# Altium schematic sheet HS0038_BOARD.SchDoc
size 420 x 297 mm; SheetNumber: 1; SheetTotal: 1
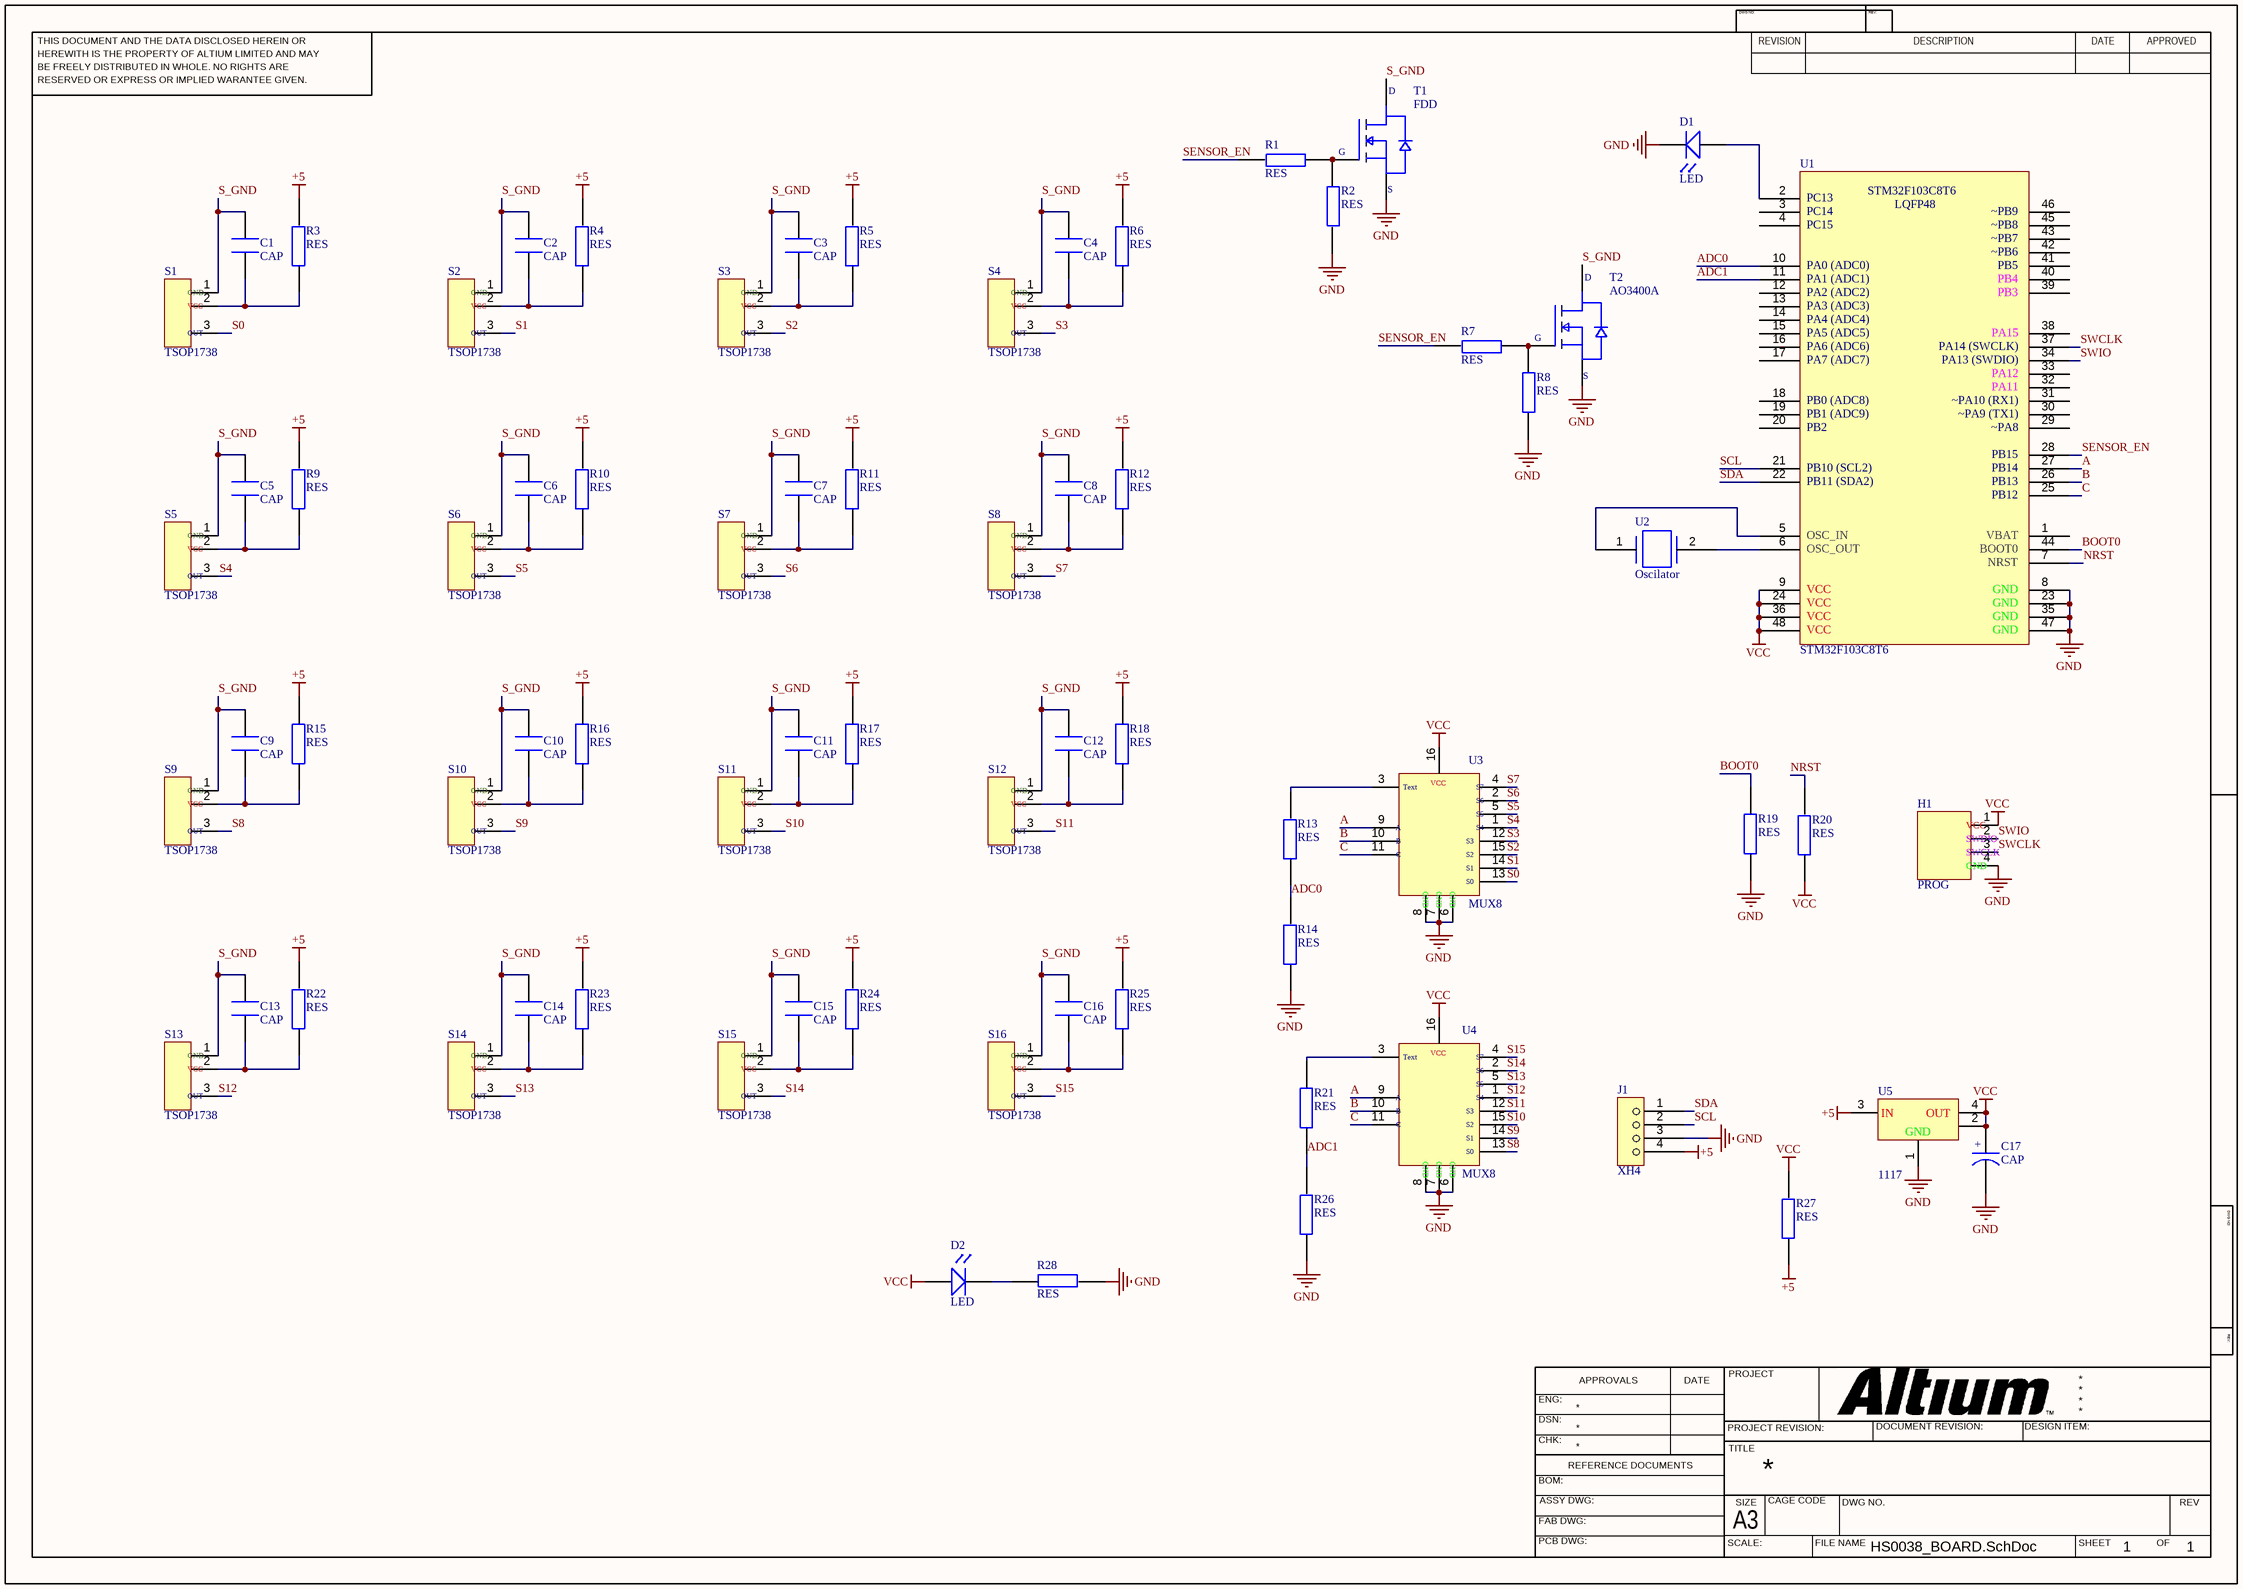
[diagram p0: HS0038_BOARD.SchDoc]

## Parts
C1  CAP  [CAP1206]
C2  CAP  [CAP1206]
C3  CAP  [CAP1206]
C4  CAP  [CAP1206]
C5  CAP  [CAP1206]
C6  CAP  [CAP1206]
C7  CAP  [CAP1206]
C8  CAP  [CAP1206]
C9  CAP  [CAP1206]
C10  CAP  [CAP1206]
C11  CAP  [CAP1206]
C12  CAP  [CAP1206]
C13  CAP  [CAP1206]
C14  CAP  [CAP1206]
C15  CAP  [CAP1206]
C16  CAP  [CAP1206]
C17  CAP  [CAP SMD 100uF 16V]
D1  LED  [LED GREEN 1206]
D2  LED  [LED GREEN 1206]
H1  PROG  [PROGRAMER]
J1  XH4  [XH 4PIN]
R1  RES  [RES1206]
R2  RES  [RES1206]
R3  RES  [RES805]
R4  RES  [RES805]
R5  RES  [RES805]
R6  RES  [RES805]
R7  RES  [RES1206]
R8  RES  [RES1206]
R9  RES  [RES805]
R10  RES  [RES805]
R11  RES  [RES805]
R12  RES  [RES805]
R13  RES  [RES1206]
R14  RES  [RES1206]
R15  RES  [RES805]
R16  RES  [RES805]
R17  RES  [RES805]
R18  RES  [RES805]
R19  RES  [RES1206]
R20  RES  [RES1206]
R21  RES  [RES1206]
R22  RES  [RES805]
R23  RES  [RES805]
R24  RES  [RES805]
R25  RES  [RES805]
R26  RES  [RES1206]
R27  RES  [RES805]
R28  RES  [RES1206]
S1  TSOP1738  [TSOP1738]
S2  TSOP1738  [TSOP1738]
S3  TSOP1738  [TSOP1738]
S4  TSOP1738  [TSOP1738]
S5  TSOP1738  [TSOP1738]
S6  TSOP1738  [TSOP1738]
S7  TSOP1738  [TSOP1738]
S8  TSOP1738  [TSOP1738]
S9  TSOP1738  [TSOP1738]
S10  TSOP1738  [TSOP1738]
S11  TSOP1738  [TSOP1738]
S12  TSOP1738  [TSOP1738]
S13  TSOP1738  [TSOP1738]
S14  TSOP1738  [TSOP1738]
S15  TSOP1738  [TSOP1738]
S16  TSOP1738  [TSOP1738]
T1  FDD  [FDD6690A]
T2  AO3400A  [AO3400A]
U1  STM32F103C8T6  [STM32F103C8T6]
U2  Oscilator  [Crystal Oscilator]
U3  MUX8  [4051 SMD]
U4  MUX8  [4051 SMD]
U5  1117  [AMS1117]

## Nets
+5: J1.4 R3.2 R4.2 R5.2 R6.2 R9.2 R10.2 R11.2 R12.2 R15.2 R16.2 R17.2 R18.2 R22.2 R23.2 R24.2 R25.2 R27.1 U5.3
GND: C17.1 D1.2 H1.4 J1.3 R2.2 R8.2 R14.1 R19.1 R26.1 R28.2 T1.3 T2.2 U1.8 U1.23 U1.35 U1.47 U3.6 U3.7 U3.8 U4.6 U4.7 U4.8 U5.1
VCC: C17.2 D2.1 H1.1 R20.1 R27.2 U1.9 U1.24 U1.36 U1.48 U3.16 U4.16 U5.2 U5.4
A: U1.27 U3.9 U4.9
ADC0: R13.1 R14.2 U1.10
ADC1: R21.1 R26.2 U1.11
B: U1.26 U3.10 U4.10
BOOT0: R19.2 U1.44
C: U1.25 U3.11 U4.11
NRST: R20.2 U1.7
S0: S1.3 U3.13
S1: S2.3 U3.14
S2: S3.3 U3.15
S3: S4.3 U3.12
S4: S5.3 U3.1
S5: S6.3 U3.5
S6: S7.3 U3.2
S7: S8.3 U3.4
S8: S9.3 U4.13
S9: S10.3 U4.14
S10: S11.3 U4.15
S11: S12.3 U4.12
S12: S13.3 U4.1
S13: S14.3 U4.5
S14: S15.3 U4.2
S15: S16.3 U4.4
S_GND: C1.2 C2.2 C3.2 C4.2 C5.2 C6.2 C7.2 C8.2 C9.2 C10.2 C11.2 C12.2 C13.2 C14.2 C15.2 C16.2 S1.1 S2.1 S3.1 S4.1 S5.1 S6.1 S7.1 S8.1 S9.1 S10.1 S11.1 S12.1 S13.1 S14.1 S15.1 S16.1 T1.4 T2.3
SCL: J1.2 U1.21
SDA: J1.1 U1.22
SENSOR_EN: R1.2 R7.2 U1.28
SWCLK: H1.3 U1.37
SWIO: H1.2 U1.34
NetC1_1: C1.1 R3.1 S1.2
NetC2_1: C2.1 R4.1 S2.2
NetC3_1: C3.1 R5.1 S3.2
NetC4_1: C4.1 R6.1 S4.2
NetC5_1: C5.1 R9.1 S5.2
NetC6_1: C6.1 R10.1 S6.2
NetC7_1: C7.1 R11.1 S7.2
NetC8_1: C8.1 R12.1 S8.2
NetC9_1: C9.1 R15.1 S9.2
NetC10_1: C10.1 R16.1 S10.2
NetC11_1: C11.1 R17.1 S11.2
NetC12_1: C12.1 R18.1 S12.2
NetC13_1: C13.1 R22.1 S13.2
NetC14_1: C14.1 R23.1 S14.2
NetC15_1: C15.1 R24.1 S15.2
NetC16_1: C16.1 R25.1 S16.2
NetD1_1: D1.1 U1.2
NetD2_2: D2.2 R28.1
NetR1_1: R1.1 R2.1 T1.1
NetR7_1: R7.1 R8.1 T2.1
NetR13_2: R13.2 U3.3
NetR21_2: R21.2 U4.3
NetU1_5: U1.5 U2.1
NetU1_6: U1.6 U2.2

Not connected (* = marked no-connect by the designer): U1 1 3 4 12 13 14 15 16 17 18 19 20 29 30 31 32 33 38 39 40 41 42 43 45 46

## Notes on the sheet
- THIS DOCUMENT AND THE DATA DISCLOSED HEREIN OR
- HEREWITH IS THE PROPERTY OF ALTIUM LIMITED AND MAY
- DWG NO:
- REVISION
- REV:
- DESCRIPTION
- DATE
- APPROVED
- BE FREELY DISTRIBUTED IN WHOLE. NO RIGHTS ARE
- RESERVED OR EXPRESS OR IMPLIED WARANTEE GIVEN.
- ENG:
- APPROVALS
- PROJECT
- DSN:
- CHK:
- REFERENCE DOCUMENTS
- PROJECT REVISION:
- TITLE
- DOCUMENT REVISION:
- DESIGN ITEM:
- BOM:
- FAB DWG:
- PCB DWG:
- ASSY DWG:
- SCALE:
- A3
- SIZE
- CAGE CODE
- FILE NAME
- DWG NO.
- SHEET
- OF
- REV
- (in symbol 4051) VCC; Text; S7; S6; S5; A; S4; B; S3; C; S2; S1; S0; GND
- (in symbol AMS1117) IN; OUT; GND
- (in symbol AO3400A) D; G; S
- (in symbol CAP Electrolit SMD) +
- (in symbol FDD6690A) D; G; S
- (in symbol Programmer) VCC; SWDIO; SWCLK; GND
- (in symbol STM32F103C8T6) PC13; LQFP48; ~PB9; PC14; ~PB8; PC15; ~PB7; ~PB6; PB5; PA0 (ADC0); PB4; PA1 (ADC1); PB3; PA2 (ADC2); PA3 (ADC3); PA4 (ADC4); PA15; PA5 (ADC5); PA14 (SWCLK); PA6 (ADC6); PA13 (SWDIO); PA7 (ADC7); PA12; PA11; ~PA10 (RX1); PB0 (ADC8); ~PA9 (TX1); PB1 (ADC9); ~PA8; PB2; PB15; PB14; PB10 (SCL2); PB13; PB11 (SDA2); PB12; VBAT; OSC_IN; BOOT0; OSC_OUT; NRST; GND; VCC
- (in symbol TSOP1738) GND; VCC; OUT

## Library data of the parts
C1-C16 = CAP1206: Capacitor SMD 1206
C17 = CAP Electrolit SMD: Capacitor Electrolit SMD
D1 D2 = LED SMD 1206
H1 = Programmer
J1 = XH 4PIN: XH Connector 4pins
R1 R2 R7 R8 R13 R14 R19-R21 R26 R28 = RES1206: RESISTOR SMD
R3-R6 R9-R12 R15-R18 R22-R25 R27 = RES805: RESISTOR SMD
S1-S16 = TSOP1738: IR SENSOR
T1 = FDD6690A: FDD6690A MOSFET N-Chanel
U1 = STM32F103C8T6: STM32F103C8T6 / LQFP48
U2 = Crystal: Crystal Oscilator 8MHz
U3 U4 = 4051: MULTIPLEXER 8 BIT
U5 = AMS1117: 3.3v Regulator